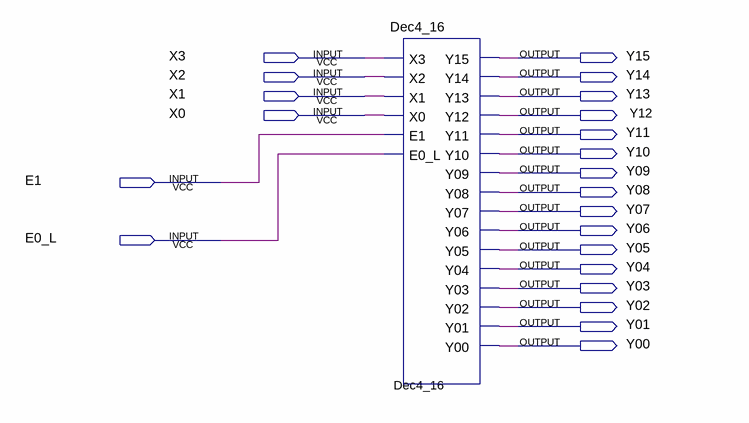
[diagram p0: schematic sheet]
// Quartus schematic DecoderDemo2.bdf as structural Verilog: 1 symbols, 22 pins
module DecoderDemo2 (
  input  X3,
  input  X2,
  input  X1,
  input  X0,
  input  E1,
  input  E0_L,
  output Y15,
  output Y14,
  output Y13,
  output Y12,
  output Y11,
  output Y10,
  output Y09,
  output Y08,
  output Y07,
  output Y06,
  output Y05,
  output Y04,
  output Y03,
  output Y02,
  output Y01,
  output Y00
);

  Dec4_16 Dec4_16 (
    .X3(X3), .X2(X2), .X1(X1), .X0(X0), .E1(E1), .E0_L(E0_L), .Y15(Y15), .Y14(Y14), .Y13(Y13), .Y12(Y12),
    .Y11(Y11), .Y10(Y10), .Y09(Y09), .Y08(Y08), .Y07(Y07), .Y06(Y06), .Y05(Y05), .Y04(Y04), .Y03(Y03),
    .Y02(Y02), .Y01(Y01), .Y00(Y00));
endmodule
